# Altium project RX_Ampboard_Round1.PrjPcb
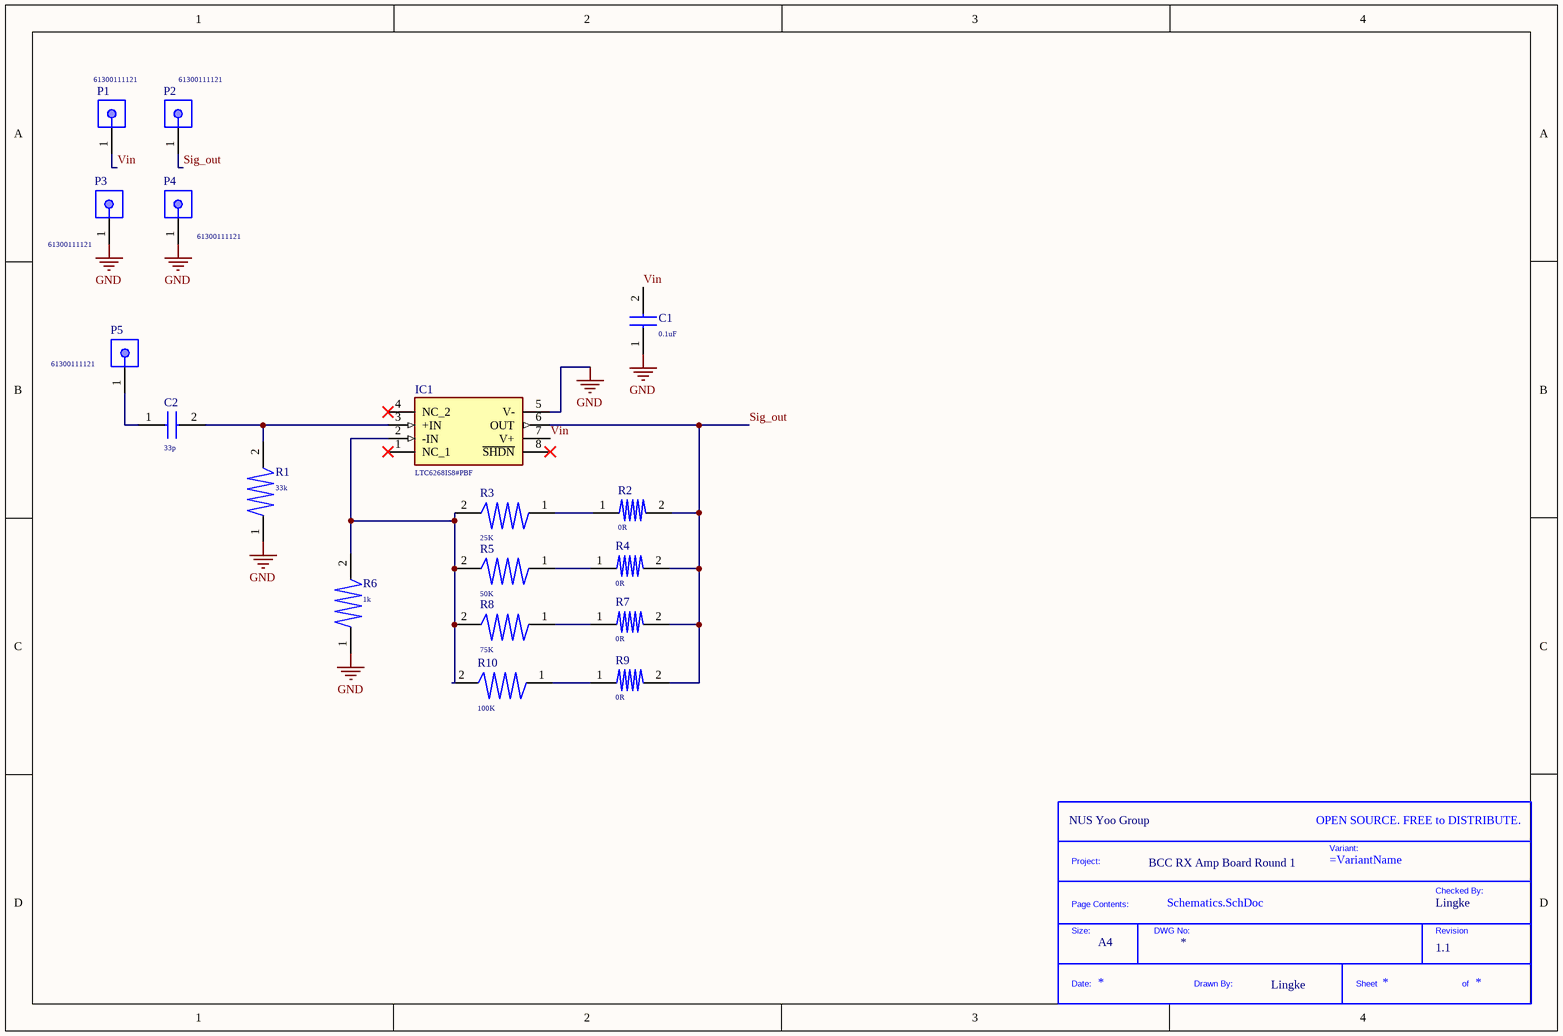
[diagram p0: Schematics.SchDoc]
1 sheet, 19 parts. Net scope: global (net labels, ports and power ports of the same name join across sheets).
Board file: Layout.PcbDoc

## Sheet Schematics.SchDoc
size A4

### Parts
*?  Project Name: BCC RX Amp Board Round 1  Company: NUS Yoo Group  Drawn By: Lingke  Revision: 1.1  Size: A4  (hidden comment: Title_Block)  (no BOM)
C1  0.1uF  [0603]
C2  33p  [0603]
IC1  LTC6268IS8#PBF  [SOIC127P599X175-8N]
P1  61300111121  [61300111121]
P2  61300111121  [61300111121]
P3  61300111121  [61300111121]
P4  61300111121  [61300111121]
P5  61300111121  [61300111121]
R1  33k  [0603]
R2  0R  [0402]
R3  25K  [0603]
R4  0R  [0402]
R5  50K  [0603]
R6  1k  [0603]
R7  0R  [0402]
R8  75K  [0603]
R9  0R  [0402]
R10  100K  [0603]

### Nets
GND: C1.1 IC1.5(V-) P3.1 P4.1 R1.1 R6.1
Sig_out: IC1.6(OUT) P2.1 R2.2 R4.2 R7.2 R9.2
Vin: C1.2 IC1.7(V+) P1.1
NetC2_1: C2.1 P5.1
NetC2_2: C2.2 IC1.3(+IN) R1.2
NetIC1_2: IC1.2(-IN) R3.2 R5.2 R6.2 R8.2 R10.2
NetR2_1: R2.1 R3.1
NetR4_1: R4.1 R5.1
NetR7_1: R7.1 R8.1
NetR9_1: R9.1 R10.1

Not connected (* = marked no-connect by the designer): IC1 1(NC_1)* 4(NC_2)* 8(~{SHDN})*

### Notes on the sheet
- (in symbol Title_Block) OPEN SOURCE. FREE to DISTRIBUTE.; Variant:; Project:; Checked By:; Page Contents:; Size:; DWG No:; Revision; Date:; Drawn By:; Sheet; of

### Library data of the parts
*? = Title_Block: Standard Title Block.; DWG No: *; Checked By: Lingke
C1 C2 = Capacitor
IC1 = LTC6268IS8#PBF: Integrated Circuit; Manufacturer_Name: Linear Technology; Datasheet Link: https://componentsearchengine.com//LTC6268IS8#PBF.pdf; Height: 1.752mm; Mouser2 Part Number: 584-LTC6268IS8#PBF; Mouser2 Price/Stock: https://www.mouser.com/Search/Refine.aspx?Keyword=584-LTC6268IS8%23PBF; Manufacturer_Part_Number: LTC6268IS8#PBF
P1-P5 = 61300111121: WR-PHD Pin Header, THT, pitch 2.54mm, Single Row, Vertical, 1p; Manufacturer: Wurth Elektronik; Pin Number: 1; Rated Current: 3A; Working Voltage: 250VAC; Withstanding Voltage: 500VAC; Contact Resistance: 20mOhm; ComponentLink1Description: Manufacturer; ComponentLink1URL: http://www.we-online.de; ComponentLink2Description: Datasheet; ComponentLink2URL: https://www.we-online.com/catalog/datasheet/61300111121.pdf; Manufacturer Part Number: 61300111121; Published Date: May 2020; Pitch: 2.54mm; Operating Temperature: -40 to +105degC; Mounting Technology: THT; Packaging: Bag; Gender: Pin Header; Row Number: Single; Orientation: Vertical
R1 R3 R5 R6 R8 R10 = Resistor 0603: Resistor
R2 R4 R7 R9 = Resistor 0402